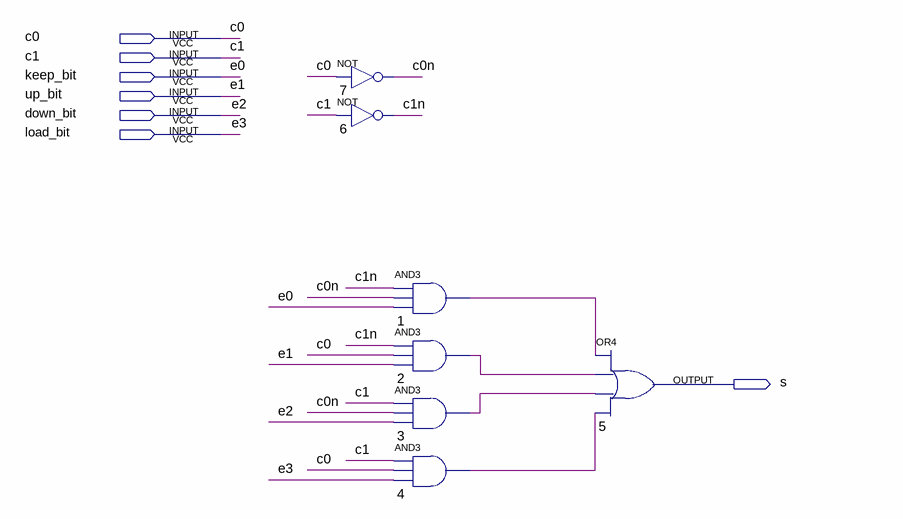
[diagram p0: schematic sheet]
// Quartus schematic mux4x1.bdf as structural Verilog: 7 symbols, 7 pins
module mux4x1 (
  input  c0,
  input  c1,
  input  keep_bit,
  input  up_bit,
  input  down_bit,
  input  load_bit,
  output s
);

  wire c0n, c1n, n1_out, n2_out, n3_out, n4_out;

  not u_7 (c0n, c0);
  not u_6 (c1n, c1);
  and u_1 (n1_out, c1n, c0n, keep_bit);
  and u_2 (n2_out, c1n, c0, up_bit);
  and u_3 (n3_out, c1, c0n, down_bit);
  and u_4 (n4_out, c1, c0, load_bit);
  or u_5 (s, n1_out, n2_out, n3_out, n4_out);

  // Other names for the same wires on the sheet: e0 = keep_bit; e1 = up_bit; e2 = down_bit; e3 = load_bit
endmodule
